# Altium schematic sheet PSU - Power Supply.SchDoc: POWER SUPPLY - Power Supply
size A3; Organization: Tekt Industries; DocumentNumber: 3; Revision: A.01; SheetNumber: 3; SheetTotal: 3; ApprovedBy: M J Adams; CheckedBy: M J Adams; Author: M J Adams; CompanyName: Tekt Industries; DrawnBy: M J Adams; Engineer: M J Adams; DocumentSize: A3; ProjectTitle: CODE OF CONSCIENCE
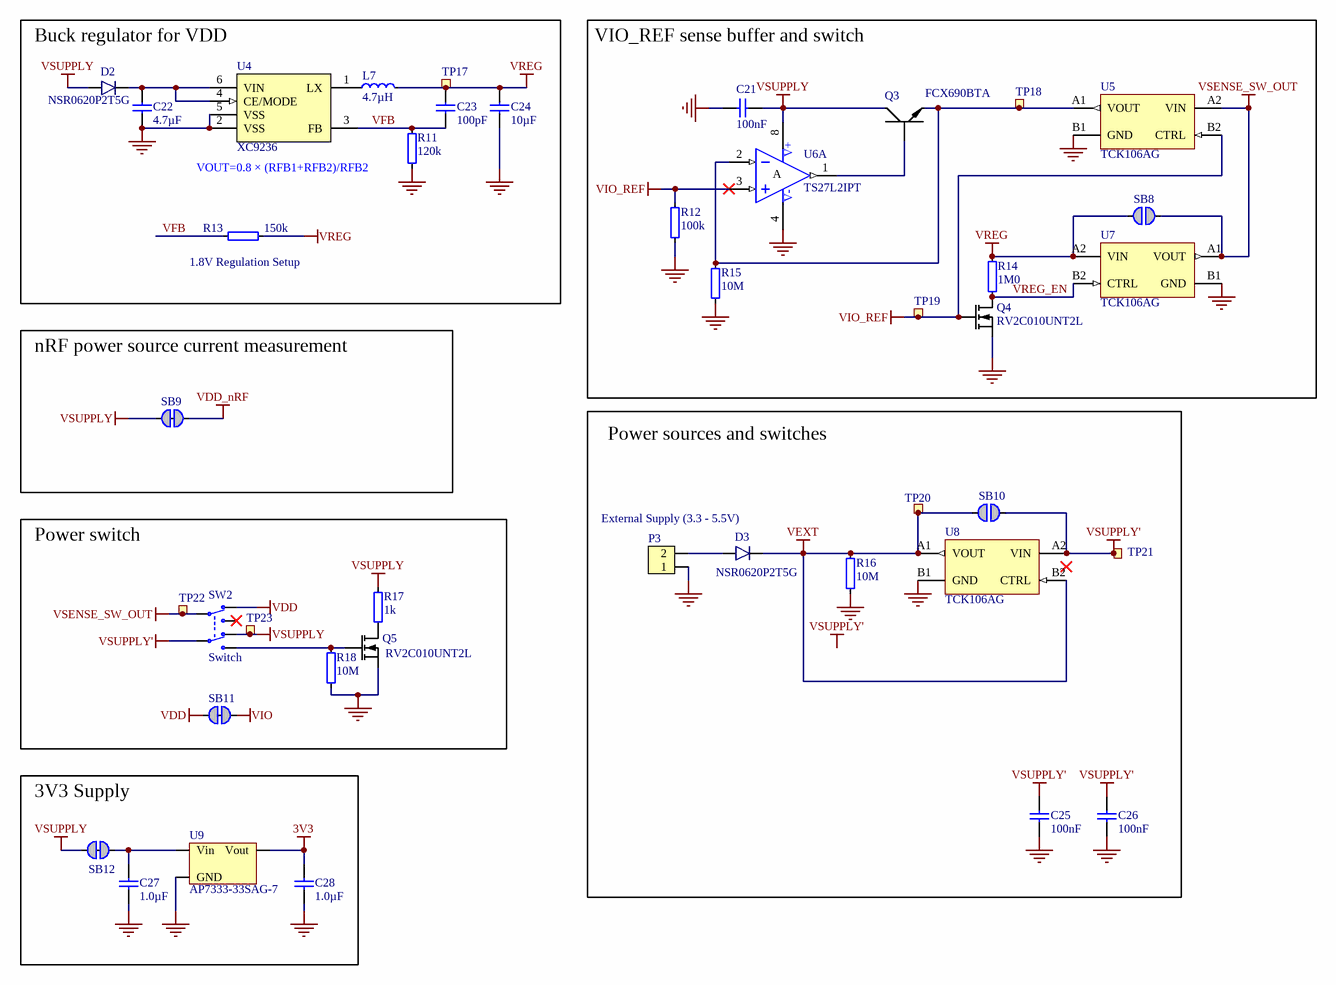
[diagram p0: PSU - Power Supply.SchDoc]

## Parts
C21  100nF  [CAPC0603X03L_C]
C22  4.7µF  [CAPC1005X04L]
C23  100pF  [CAPC0603X03L_C]
C24  10µF  [CAPC1608X06L]
C25  100nF  [CAPC0603X03L_C]
C26  100nF  [CAPC0603X03L_C]
C27  1.0µF  [CAPC0603X03L_C]
C28  1.0µF  [CAPC0603X03L_C]
D2  NSR0620P2T5G  [SODFL100X40-2N]
D3  NSR0620P2T5G  [SODFL100X40-2N]
L7  4.7µH  [TY-NR3015]
P3  Pin List 1x2, Angled  [LIST_ANG_1x2-SMD-2.54MM]  (value not drawn)
Q3  FCX690BTA  [SOT89-150P409X160-3N]
Q4  RV2C010UNT2L  [DFN65P100X40-3L]
Q5  RV2C010UNT2L  [DFN65P100X40-3L]
R11  120k  [RESC0603X03L_C]
R12  100k  [RESC0603X03L_C]
R13  150k  [RESC0603X03L_C]
R14  1M0  [RESC0603X03L_C]
R15  10M  [RESC0603X03L_C]
R16  10M  [RESC0603X03L_C]
R17  1k  [RESC0603X03L_C]
R18  10M  [RESC0603X03L_C]
SB8  Solderbridge  [Solderbridge]  (value not drawn)  (no BOM)
SB9  Solderbridge  [Solderbridge_Shorted]  (value not drawn)  (net tie, no BOM)
SB10  Solderbridge  [Solderbridge]  (value not drawn)  (no BOM)
SB11  Solderbridge  [Solderbridge_Shorted]  (value not drawn)  (net tie, no BOM)
SB12  Solderbridge  [Solderbridge_Shorted]  (value not drawn)  (net tie, no BOM)
SW2  Switch  [Switch-Slide-RA-J-Lead-DPDT-8.5x3.5mm]
TP17  Ø1.5mm,SMD  [TP_SMD_Ø1.5mm]  (value not drawn)  (no BOM)
TP18  Ø1.5mm,SMD  [TP_SMD_Ø1.5mm]  (value not drawn)  (no BOM)
TP19  Ø1.5mm,SMD  [TP_SMD_Ø1.5mm]  (value not drawn)  (no BOM)
TP20  Ø1.5mm,SMD  [TP_SMD_Ø1.5mm]  (value not drawn)  (no BOM)
TP21  Ø1.5mm,SMD  [TP_SMD_Ø1.5mm]  (value not drawn)  (no BOM)
TP22  Ø1.5mm,SMD  [TP_SMD_Ø1.5mm]  (value not drawn)  (no BOM)
TP23  Ø1.5mm,SMD  [TP_SMD_Ø1.5mm]  (value not drawn)  (no BOM)
U4  XC9236  [USP-6C]
U5  TCK106AG  [TCK106AG]
U6  TS27L2IPT  [TSOP65P640X120-8N]  (part A of 2)
U7  TCK106AG  [TCK106AG]
U8  TCK106AG  [TCK106AG]
U9  AP7333-33SAG-7  [SOT-23A]

## Blocks framed on the sheet
Buck regulator for VDD: C22-C24 D2 L7 R11 R13 TP17 U4
VIO_REF sense buffer and switch: C21 Q3 Q4 R12 R14 R15 SB8 TP18 TP19 U5-U7
nRF power source current measurement: SB9
Power sources and switches: C25 C26 D3 P3 R16 SB10 TP20 TP21 U8
Power switch: Q5 R17 R18 SB11 SW2 TP22 TP23
3V3 Supply: C27 C28 SB12 U9

## Nets
3V3: C28.1 U9.2(Vout)
GND: C21.1 C22.1 C24.1 C25.2 C26.1 C27.2 C28.2 P3.1 Q4.2(S) Q5.2(S) R11.1 R12.2 R15.1 R16.1 R18.1 U4.2(VSS) U4.5(VSS) U4.7(VSS) U5.B1(GND) U6.4(V-) U7.B1(GND) U8.B1(GND) U9.3(GND)
VDD: SB11.2 SW2.3(N.C-1)
VDD_nRF: SB9.2
VEXT: D3.1(C) R16.2 SB10.2 TP20.1 U8.A1(VOUT) U8.B2(CTRL)
VIO: SB11.1
VIO_REF: Q4.1(G) R12.1 TP19.1 U5.B2(CTRL) U6.3(IN1+)
VREG: C23.2 C24.2 L7.2 R13.2 R14.2 SB8.2 TP17.1 U7.A2(VIN)
VSENSE_SW_OUT: SB8.1 SW2.2(COM-1) TP22.1 U5.A2(VIN) U7.A1(VOUT)
VSUPPLY: C21.2 D2.2(A) Q3.2(C) R17.2 SB9.1 SB12.2 SW2.6(N.C-2) TP23.1 U6.8(V+)
VSUPPLY': C25.1 C26.2 SB10.1 SW2.5(COM-2) TP21.1 U8.A2(VIN)
VFB: C23.1 R11.2 R13.1 U4.3(FB)
VREG_EN: Q4.3(D) R14.1 U7.B2(CTRL)
NetC22_2: C22.2 D2.1(C) U4.4(CE/MODE) U4.6(VIN)
NetC27_1: C27.1 SB12.1 U9.1(Vin)
NetD3_2: D3.2(A) P3.2
NetL7_1: L7.1 U4.1(LX)
NetQ3_1: Q3.1(B) U6.1(OUT1)
NetQ3_3: Q3.3(E) R15.2 TP18.1 U5.A1(VOUT) U6.2(IN1-)
NetQ5_1: Q5.1(G) R18.2 SW2.4(N.O-2)
NetQ5_3: Q5.3(D) R17.1

Not connected (* = marked no-connect by the designer): SW2 1(N.O-1)*

## Notes on the sheet
- VOUT=0.8 × (RFB1+RFB2)/RFB2
- (near R13) 1.8V Regulation Setup
- External Supply (3.3 - 5.5V)
- Labels drawn without touching a wire or pin: VSUPPLY'
- Title:
- Date:
- Revision:
- Client:
- Sheet:
- Time:
- Format:
- A3
- of
- Checked By:
- Approved By:
- Drawn By:
- Tekt Industries Pty. Ltd.
  386 Johnston Street
  Abbotsford, VIC
  Australia, 3067
- This documentation contains information which is provided AS IS, without attribution of liability or warranty under the GNU GPL v2.0 License - Open Source and permissive for commercial use, modification, distribution, and private use.
- File:
- (in symbol TS27L2IPT, part A) A

## Library data of the parts
C21 C25 C26 = C0201-100n: Capacitor, X5R, ±10%; Manufacturer: Murata Electronics North America; Manufacturer Part No.: GRM033R61C104KE84D; Part number IPS: 00000001248; Note: 16V; Artikkelnr Noca: N.A.; Part Number: C0201-100n; ComponentLink1URL: *; ComponentLink1Description: Datasheet; ComponentLink2URL: *; ComponentLink2Description: Supplier link; HelpURL: *; Footprint Doc: 0201; LatestRevisionDate: 2017-11-09; Pin Count: 2; Publisher: Nordic Semiconductor; Published: 2014-11-13; Value: 100nF; Supplier: Digi-Key; Supplier Part No.: 490-9985-1-ND; Supplier 2: *; Supplier Part Number 2: *
C22 = C0402-4µ7: Capacitor, X5R, ±20%; Manufacturer: Murata Electronics North America; Manufacturer Part No.: ZRB15XR61A475KE01D; Part number IPS: 00000001251; Note: 10V; Artikkelnr Noca: 20039482; Part Number: C0402-4µ7; ComponentLink1URL: *; ComponentLink1Description: Datasheet; ComponentLink2URL: *; ComponentLink2Description: Supplier link; HelpURL: *; Footprint Doc: 0402; LatestRevisionDate: 2017-11-09; Pin Count: 2; Publisher: Nordic Semiconductor; Published: 2009-05-08; Value: 4.7µF; Supplier: Digi-Key; Supplier Part No.: 490-13252-1-ND; Supplier 2: *; Supplier Part Number 2: *
C23 = C0201-100p: Capacitor, NP0, ±2%; Manufacturer: Murata Electronics North America; Manufacturer Part No.: GRM0335C1E101JA01D; Part number IPS: 00000007853; Note: 25V; Artikkelnr Noca: N.A.; Part Number: C0201-100p; ComponentLink1URL: *; ComponentLink1Description: Datasheet; ComponentLink2URL: *; ComponentLink2Description: Supplier link; HelpURL: *; Footprint Doc: 0201; LatestRevisionDate: 2017-11-09; Pin Count: 2; Publisher: Nordic Semiconductor; Published: 2014-11-13; Value: 100pF; Supplier: Digi-Key; Supplier Part No.: 490-3160-1-ND; Supplier 2: *; Supplier Part Number 2: *
C24 = C0603-10µF-25V: Capacitor, 0603, 25V, X5R; Manufacturer: Murata Electronics North America; Manufacturer Part No.: ZRB18AR61E106ME01L; Part number IPS: N.A.; Artikkelnr Noca: 20039436; Part Number: C0603-10µF-25V; Footprint Doc: 0603; LatestRevisionDate: 2015-02-25; Pin Count: 2; Publisher: Nordic Semiconductor; Published: 2015-02-25; Value: 10µF; Note: 25V; ComponentLink1URL: *; ComponentLink1Description: Datasheet; ComponentLink2URL: *; ComponentLink2Description: Supplier link; HelpURL: *; Supplier: Digi-Key; Supplier Part No.: 490-10991-1-ND; Supplier 2: *; Supplier Part Number 2: *
C27 C28 = C0201-1µ0: Capacitor, X5R, ±10%; Manufacturer: Samsung Electro-Mechanics; Manufacturer Part No.: CL03A105KP3NSNC; Note: 10V; Artikkelnr Noca: N.A.; Part Number: C0201-1µ0; ComponentLink1URL: *; ComponentLink1Description: Datasheet; ComponentLink2URL: *; ComponentLink2Description: Supplier link; HelpURL: *; Footprint Doc: 0201; LatestRevisionDate: 2016-08-22; Pin Count: 2; Publisher: Nordic Semiconductor; Published: 2009-05-08; Value: 1.0µF; Supplier: Digi-Key; Supplier Part No.: 1276-6795-1-ND; Supplier 2: *; Supplier Part Number 2: *; Part number IPS: N.A.
D2 D3 = NSR0620P2T5G: 20V schottky barrier diode, Vf 350 mV @ 100 mA, Ir 2.0 µA @ 10 V, If 500 mA; Manufacturer: ON Semiconductor; Part number IPS: N.A.; Artikkelnr Noca: 10029169; Part Number: NSR0620P2T5G; Manufacturer Part No.: NSR0620P2T5G; LatestRevisionDate: 2016-07-07; Publisher: Nordic Semiconductor; Published: 2016-07-07; Value: NSR0620P2T5G; Note: *; Footprint Doc: SOD-923; ComponentLink1URL: *; ComponentLink1Description: Datasheet; ComponentLink2URL: *; ComponentLink2Description: Supplier link; HelpURL: http://www.onsemi.com/pub_link/Collateral/NSR0620P2-D.PDF; Pin Count: 2; Supplier: Digi-Key; Supplier Part No.: NSR0620P2T5GOSCT-ND; Supplier 2: *; Supplier Part Number 2: *
L7 = NR3015-4µ7-1.04A-144mOhm: Ferrite Inductor, Shielded, 1,04A, 144mOhm; Manufacturer: Taiyo Yuden; Manufacturer Part No.: NR3015T4R7M; Part number IPS: N.A.; Artikkelnr Noca: 33029551; Part Number: NR3015-4µ7-1.04A-144mOhm; Footprint Doc: 1212; LatestRevisionDate: 2014-01-22; Pin Count: 2; Publisher: Nordic Semiconductor; Published: 2014-01-22; Value: 4.7µH; Note: *; ComponentLink1URL: *; ComponentLink1Description: Datasheet; ComponentLink2URL: *; ComponentLink2Description: Supplier link; HelpURL: http://www.yuden.co.jp/ut/product/category/inductor/NR3015T4R7M.pdf; Supplier: Digi-Key; Supplier Part No.: 587-1649-1-ND; Supplier 2: Mouser; Supplier Part Number 2: 963-NR3015T4R7M
P3 = Pin List Ang 1x2 SMD, 2.54mm: Pin List 1x2, 2.54mm (100mil), Right Angled, SMD; Manufacturer: Samtec Inc.; Manufacturer Part No.: TSM-102-01-L-SH-A; Part number IPS: N.A.; Artikkelnr Noca: 55010023; Part Number: Pin List Ang 1x2 SMD, 2.54mm; Footprint Doc: LIST_ANG_1x2-SMD-2.54MM; LatestRevisionDate: 2016-05-26; Pin Count: 2; Publisher: Nordic Semiconductor; Published: 2016-01-22; Value: Pin List 1x2, Angled; Note: *; ComponentLink1URL: *; ComponentLink1Description: Datasheet; ComponentLink2URL: *; ComponentLink2Description: Supplier link; HelpURL: \\hizz\pro\app9717\Datasheet\connectores\W-CON\1125B-11XXXXZXXXXX.pdf; Supplier: Digi-Key; Supplier Part No.: SAM10266-ND; Supplier 2: Samtec; Supplier Part Number 2: TSM-102-01-L-SH-A
Q3 = FCX690BTA: 45V NPN high gain power transistor; Manufacturer: Diodes Incorporated; Part number IPS: N.A.; Artikkelnr Noca: 35010019; Part Number: FCX690BTA; Manufacturer Part No.: FCX690BTA; Footprint Doc: SOT-89; LatestRevisionDate: 2016-07-07; Publisher: Nordic Semiconductor; Published: 2016-07-07; Value: FCX690BTA; Note: *; ComponentLink1URL: *; ComponentLink1Description: Datasheet; ComponentLink2URL: *; ComponentLink2Description: Supplier link; HelpURL: http://www.diodes.com/_files/datasheets/FCX690B.pdf; Pin Count: 3; Supplier: Digi-Key; Supplier Part No.: FCX690BCT-ND; Supplier 2: *; Supplier Part Number 2: *
Q4 Q5 = RV2C010UNT2L: N-Channel MOSFET, 20V, 1A, 470mOhm, 400mW; Manufacturer: Rohm Semiconductor; Part number IPS: N.A.; Artikkelnr Noca: 35010020; Part Number: RV2C010UNT2L; Manufacturer Part No.: RV2C010UNT2L; LatestRevisionDate: 2016-08-09; Publisher: Nordic Semiconductor; Published: 2016-08-09; Value: RV2C010UNT2L; Note: *; Footprint Doc: DFN-3; ComponentLink1URL: *; ComponentLink1Description: Datasheet; ComponentLink2URL: *; ComponentLink2Description: Supplier link; HelpURL: http://rohmfs.rohm.com/en/products/databook/datasheet/discrete/transistor/mosfet/rv2c010unt2l-e.pdf; Pin Count: 3; Supplier: Digi-Key; Supplier Part No.: RV2C010UNT2LCT-ND; Supplier 2: Mouser; Supplier Part Number 2: 755-RV2C010UNT2L
R11 = R0201-120k: Resistor, ±1%, 0.05W; Manufacturer: Yageo; Manufacturer Part No.: RC0201FR-07120KL; Note: Chip Res 1%; Artikkelnr Noca: N.A.; Part Number: R0201-120k; ComponentLink1URL: *; ComponentLink1Description: Datasheet; ComponentLink2URL: *; ComponentLink2Description: Supplier link; HelpURL: *; Footprint Doc: 0201; LatestRevisionDate: 2014-11-13; Pin Count: 2; Publisher: Nordic Semiconductor; Published: 2014-11-13; Value: 120k; Part number IPS: N.A.; Supplier: Digi-Key; Supplier Part No.: 311-120KMCT-ND; Supplier 2: *; Supplier Part Number 2: *
R12 = R0201-100k: Resistor, ±1%, 0.05W; Manufacturer: Yageo; Manufacturer Part No.: RC0201FR-07100KL; Note: Chip Res 1%; Artikkelnr Noca: N.A.; Part Number: R0201-100k; ComponentLink1URL: *; ComponentLink1Description: Datasheet; ComponentLink2URL: *; ComponentLink2Description: Supplier link; HelpURL: *; Footprint Doc: 0201; LatestRevisionDate: 2014-11-13; Pin Count: 2; Publisher: Nordic Semiconductor; Published: 2014-11-13; Value: 100k; Supplier: Digi-Key; Supplier Part No.: 311-100KMCT-ND; Supplier 2: *; Supplier Part Number 2: *; Part number IPS: N.A.
R13 = R0201-150k: Resistor, ±1%, 0.05W; Manufacturer: Stackpole Electronics Inc; Manufacturer Part No.: RMCF0201FT150K; Note: Chip Res 1%; Artikkelnr Noca: N.A.; Part Number: R0201-150k; ComponentLink1URL: *; ComponentLink1Description: Datasheet; ComponentLink2URL: *; ComponentLink2Description: Supplier link; HelpURL: *; Footprint Doc: 0201; LatestRevisionDate: 2014-11-13; Pin Count: 2; Publisher: Nordic Semiconductor; Published: 2014-11-13; Value: 150k; Part number IPS: N.A.; Supplier: Digi-Key; Supplier Part No.: RMCF0201FT150KCT-ND; Supplier 2: *; Supplier Part Number 2: *
R14 = R0201-1M0: Resistor, ±1%, 0.05W; Manufacturer: Yageo; Manufacturer Part No.: RC0201FR-071ML; Note: Chip Res 1%; Artikkelnr Noca: N.A.; Part Number: R0201-1M0; ComponentLink1URL: *; ComponentLink1Description: Datasheet; ComponentLink2URL: *; ComponentLink2Description: Supplier link; HelpURL: *; Footprint Doc: 0201; LatestRevisionDate: 2014-11-13; Pin Count: 2; Publisher: Nordic Semiconductor; Published: 2014-11-13; Value: 1M0; Part number IPS: N.A.; Supplier: Digi-Key; Supplier Part No.: 311-1MMCT-ND; Supplier 2: *; Supplier Part Number 2: *
R15 R16 R18 = R0201-10M: Resistor, ±1%, 0.05W; Manufacturer: KOA Speer Electronics, Inc.; Manufacturer Part No.: RK73H1HTTC1005F; Note: Chip Res 1%; Artikkelnr Noca: N.A.; Part Number: R0201-10M; ComponentLink1URL: *; ComponentLink1Description: Datasheet; ComponentLink2URL: *; ComponentLink2Description: Supplier link; HelpURL: *; Footprint Doc: 0201; LatestRevisionDate: 2014-11-13; Pin Count: 2; Publisher: Nordic Semiconductor; Published: 2014-11-13; Value: 10M; Part number IPS: N.A.; Supplier: Digi-Key; Supplier Part No.: 2019-RK73H1HTTC1005FCT-ND; Supplier 2: *; Supplier Part Number 2: *
R17 = R0201-1k0: Resistor, ±1%, 0.05W; Manufacturer: Yageo; Manufacturer Part No.: RC0201FR-071KL; Note: Chip Res 1%; Artikkelnr Noca: N.A.; Part Number: R0201-1k0; ComponentLink1URL: *; ComponentLink1Description: Datasheet; ComponentLink2URL: *; ComponentLink2Description: Supplier link; HelpURL: *; Footprint Doc: 0201; LatestRevisionDate: 2014-11-13; Pin Count: 2; Publisher: Nordic Semiconductor; Published: 2014-11-13; Value: 1k; Part number IPS: N.A.; Supplier: Digi-Key; Supplier Part No.: 311-1KMCT-ND; Supplier 2: *; Supplier Part Number 2: *
SB8 SB10 = Solderbridge: Artikkelnr Noca: N.A.; Part Number: Solderbridge; LatestRevisionDate: 2009-12-14; Pin Count: 2; Publisher: Nordic Semiconductor; Published: 2009-12-14; Value: Solderbridge; Note: *; Footprint Doc: Solderbridge; Part number IPS: N.A.; ComponentLink1URL: *; ComponentLink1Description: Datasheet; ComponentLink2URL: *; ComponentLink2Description: Supplier link; HelpURL: *; Supplier Part No.: *; Supplier 2: *
SB9 SB11 SB12 = Solderbridge Shorted: Shorted Solderbridge; Artikkelnr Noca: N.A.; Part Number: Solderbridge Shorted; LatestRevisionDate: 2012-08-07; Pin Count: 2; Publisher: Nordic Semiconductor; Published: 2012-08-07; Value: Solderbridge; Note: *; Footprint Doc: Solderbridge_Shorted; Part number IPS: N.A.; ComponentLink1URL: *; ComponentLink1Description: Datasheet; ComponentLink2URL: *; ComponentLink2Description: Supplier link; HelpURL: *; Supplier Part No.: *; Supplier 2: *
SW2 = Switch-Slide-RA-J-Lead-DPDT-8.5x3.5mm_C&K: SMD slide Switch (ON-ON); Manufacturer: C&K Components; Manufacturer Part No.: JS202011JAQN; Part number IPS: 00000007811; Artikkelnr Noca: N.A.; Part Number: Switch-Slide-RA-J-Lead-DPDT-8.5x3.5mm_C&K; Footprint Doc: Switch-Slide-RA-J-Lead-DPDT-8.5x3.5mm; LatestRevisionDate: 2017-02-01; Pin Count: 6; Publisher: Nordic Semiconductor; Published: 2016-09-15; Value: Switch; Note: *; ComponentLink1URL: *; ComponentLink1Description: Datasheet; ComponentLink2URL: *; ComponentLink2Description: Supplier link; HelpURL: http://www.ck-components.com/media/1422/js.pdf; Supplier: Digi-Key; Supplier Part No.: CKN10722CT-ND; Supplier 2: Mouser; Supplier Part Number 2: 611-JS202011JAQN
TP17-TP23 = TP_SMD_Ø1.5MM: 1.0mm circular SMD testpad; Artikkelnr Noca: N.A.; Part Number: TP_SMD_Ø1.5MM; ComponentLink1URL: *; ComponentLink1Description: Datasheet; ComponentLink2URL: *; ComponentLink2Description: Supplier link; HelpURL: *; Footprint Doc: TP_SMD_Ø1.5mm; LatestRevisionDate: 2016-06-02; Pin Count: 1; Publisher: Nordic Semiconductor; Published: 2016-06-02; Value: Ø1.5mm,SMD; Note: *; Part number IPS: N.A.; Supplier Part No.: *; Supplier 2: *
U4 = XC9236F08CER-G: 600mA Driver Transistor Built-In, Synchronous Step-Down DC/DC Converters; Manufacturer: Torex Semiconductor; Artikkelnr Noca: N.A.; Part Number: XC9236F08CER-G; Manufacturer Part No.: XC9236F08CER-G; Footprint Doc: USP-6C; LatestRevisionDate: 2017-11-15; Pin Count: 6; Publisher: Nordic Semiconductor; Published: 2016-08-08; Value: XC9236; Note: *; Part number IPS: N.A.; ComponentLink1URL: *; ComponentLink1Description: Datasheet; ComponentLink2URL: *; ComponentLink2Description: Supplier link; HelpURL: http://www.torexsemi.com/products/dcdc_converters/data/XC9235~37.pdf; Supplier: Mouser; Supplier Part No.: 865-XC9236F08CER-G; Supplier 2: *; Supplier Part Number 2: *
U5 U7 U8 = TCK106AG: IC POWER DIST LOAD SWITCH 4WCSP; Manufacturer: Toshiba; Manufacturer Part No.: TCK106AG,LF; Artikkelnr Noca: N.A.; Part Number: TCK106AG; ComponentLink1URL: https://toshiba.semicon-storage.com/info/docget.jsp?did=30131&prodName=TCK106AG; ComponentLink1Description: Datasheet; ComponentLink2URL: *; ComponentLink2Description: Supplier link; HelpURL: *; Footprint Doc: 4-WCSPD; LatestRevisionDate: 2019-02-17; Pin Count: 4; Publisher: Nordic Semiconductor; Published: 2019-02-17; Value: TCK106AG; Note: *; Supplier: Digi-Key; Supplier Part No.: TCK106AGLFTR-ND; Supplier 2: Mouser; Supplier Part Number 2: 757-TCK106AGLF; Part number IPS: N.A.
U6 = TS27L2IPT: Precision very low power CMOS dual operational amplifier; Manufacturer: STMicroelectronics; Part number IPS: N.A.; Artikkelnr Noca: 17010019; Part Number: TS27L2IPT; Manufacturer Part No.: TS27L2IPT; Footprint Doc: TSSOP-8; LatestRevisionDate: 2016-07-07; Pin Count: 8; Publisher: Nordic Semiconductor; Published: 2016-07-07; Value: TS27L2IPT; Note: *; ComponentLink1URL: *; ComponentLink1Description: Datasheet; ComponentLink2URL: *; ComponentLink2Description: Supplier link; HelpURL: http://www.st.com/content/ccc/resource/technical/document/datasheet/38/5b/ca/bd/c0/26/4a/34/CD00000880.pdf/files/CD00000880.pdf/jcr:content/translations/en.CD00000880.pdf; Supplier: Digi-Key; Supplier Part No.: 497-8085-1-ND; Supplier 2: *; Supplier Part Number 2: *
U9 = AP7333-33SAG-7: 300mA, Low Quiescent Current, Fast Transient Low Dropout Linear Regulator; Manufacturer: Diodes Incorporated; Part number IPS: N.A.; Artikkelnr Noca: 17039216; Part Number: AP7333-33SAG-7; Manufacturer Part No.: AP7333-33SAG-7; ComponentLink1URL: *; ComponentLink1Description: Datasheet; ComponentLink2URL: *; ComponentLink2Description: Supplier link; HelpURL: http://www.diodes.com/datasheets/AP7333.pdf; Footprint Doc: SOT-23-3; LatestRevisionDate: 2012-06-15; Pin Count: 3; Publisher: Nordic Semiconductor; Published: 2012-06-15; Value: AP7333-33SAG-7; Note: *; Supplier: Digi-Key; Supplier Part No.: AP7333-33SAG-7DICT-ND; Supplier 2: *; Supplier Part Number 2: *